# EAGLE design bugs (EAGLE 9.1.1)
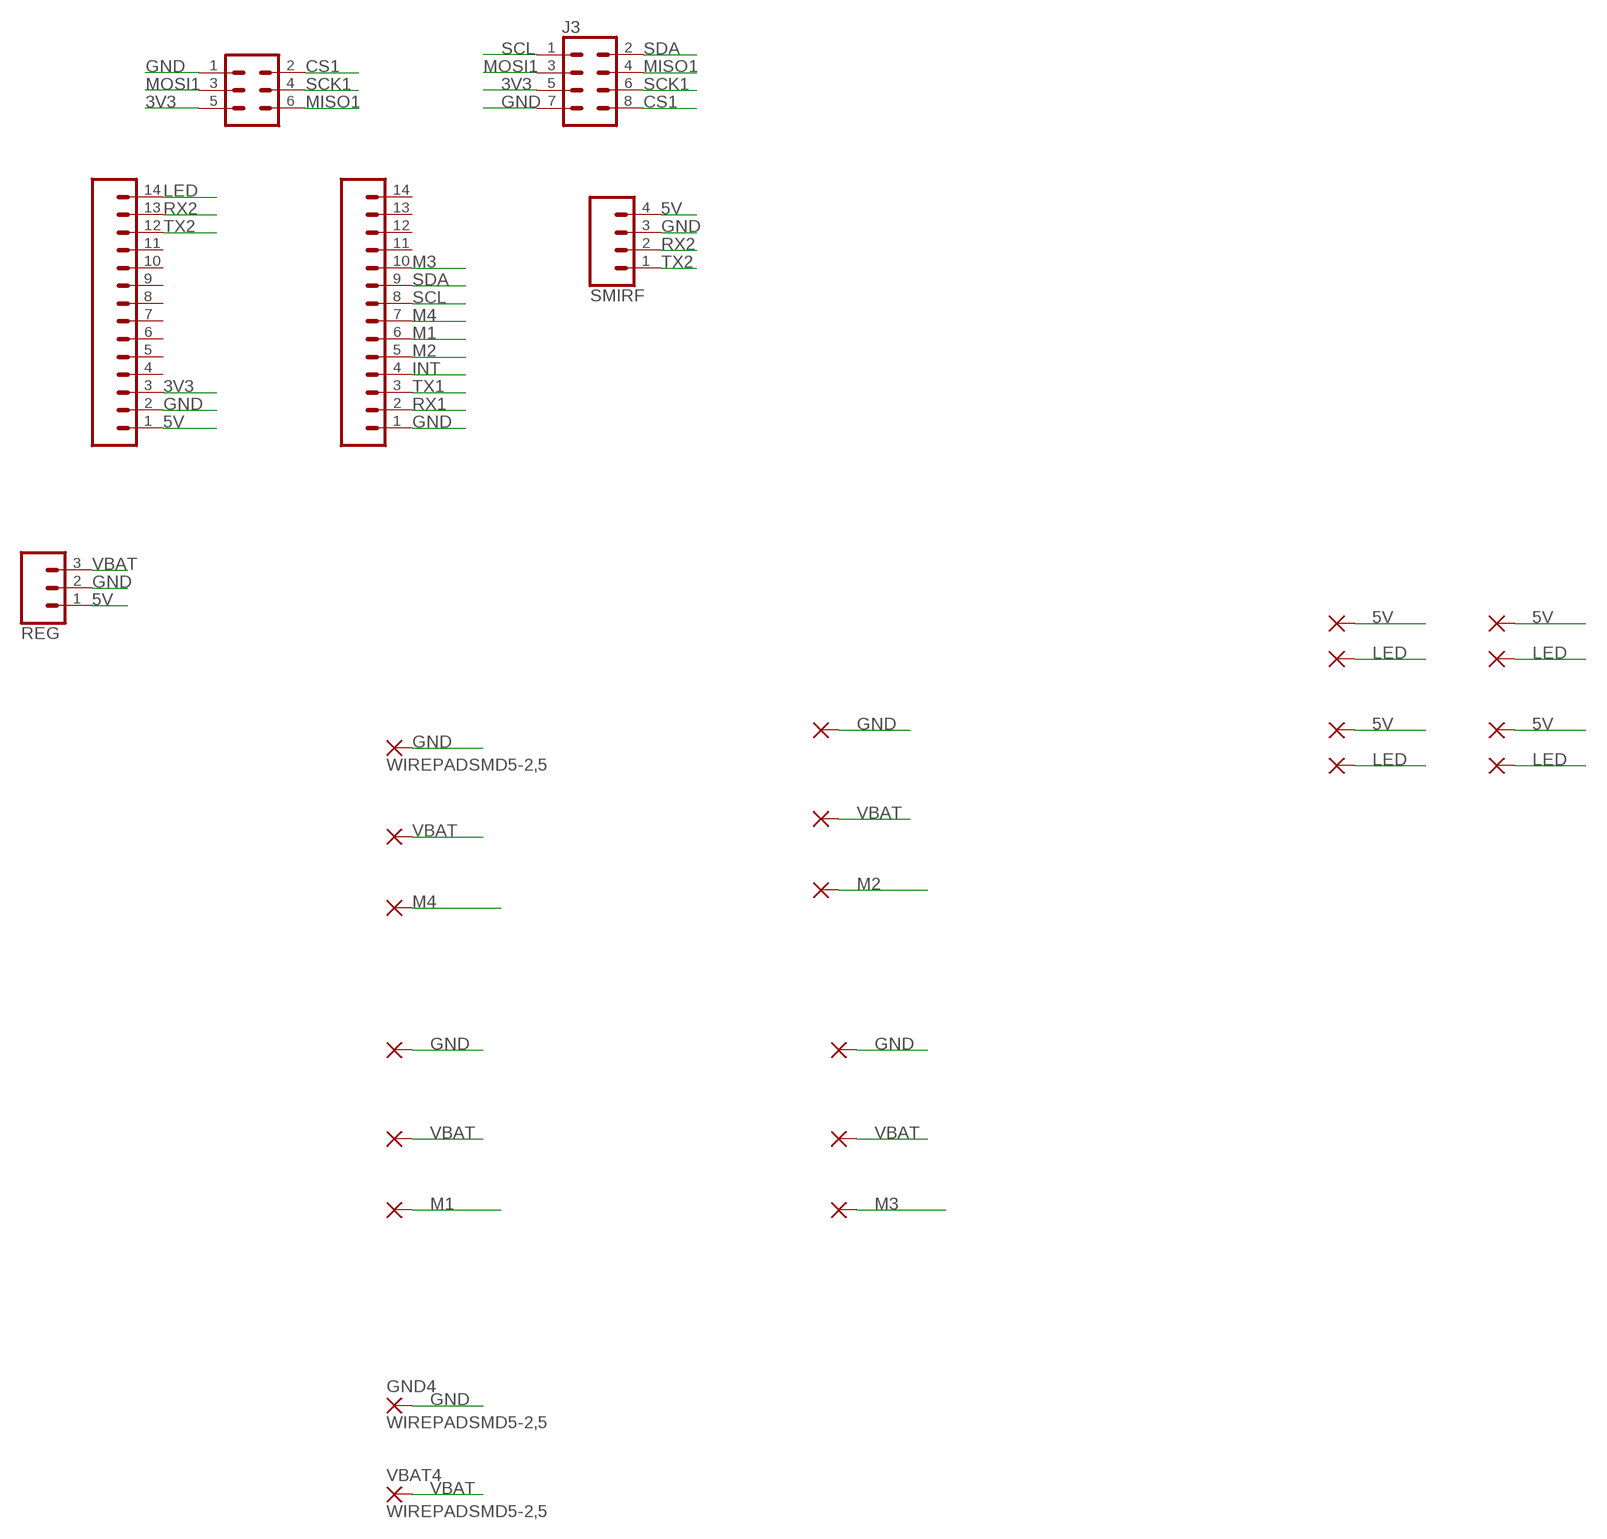
[diagram p0: schematic, sheet 1]

## Parts
GND  WIREPADSMD5-2,5  [5-2,5]
GND1  WIREPADSMD5-2,5  [5-2,5]
GND2  WIREPADSMD5-2,5  [5-2,5]
GND3  WIREPADSMD5-2,5  [5-2,5]
GND4  WIREPADSMD5-2,5  [5-2,5]
J1  CONN_03X2NO_SILK  [2X3-NS]
J3  CONN_04X2  [2X4]
J6  CONN_14NO_SILK  [1X14_NO_SILK]
J7  CONN_14NO_SILK  [1X14_NO_SILK]
M1  WIREPADSMD5-2,5  [5-2,5]
M2  WIREPADSMD5-2,5  [5-2,5]
M3  WIREPADSMD5-2,5  [5-2,5]
M4  WIREPADSMD5-2,5  [5-2,5]
PAD1  SMD2  [SMD1,27-2,54]
PAD2  SMD2  [SMD1,27-2,54]
PAD3  SMD2  [SMD1,27-2,54]
PAD4  SMD2  [SMD1,27-2,54]
PAD5  SMD2  [SMD1,27-2,54]
PAD6  SMD2  [SMD1,27-2,54]
PAD7  SMD2  [SMD1,27-2,54]
PAD8  SMD2  [SMD1,27-2,54]
REG  REG  CONN_031X03_NO_SILK  [1X03_NO_SILK]
SMIRF  SMIRF  CONN_041X04_NO_SILK  [1X04_NO_SILK]
VBAT  WIREPADSMD5-2,5  [5-2,5]
VBAT1  WIREPADSMD5-2,5  [5-2,5]
VBAT2  WIREPADSMD5-2,5  [5-2,5]
VBAT3  WIREPADSMD5-2,5  [5-2,5]
VBAT4  WIREPADSMD5-2,5  [5-2,5]

## Nets
3V3: J1.5 J3.5 J6.3
5V: J6.1 PAD1.1(P) PAD3.1(P) PAD5.1(P) PAD7.1(P) REG.1 SMIRF.4
CS1: J1.2 J3.8
GND: GND1.1(P) GND2.1(P) GND3.1(P) GND4.1(P) GND.1(P) J1.1 J3.7 J6.2 J7.1 REG.2 SMIRF.3
INT: J7.4
LED: J6.14 PAD2.1(P) PAD4.1(P) PAD6.1(P) PAD8.1(P)
M1: J7.6 M1.1(P)
M2: J7.5 M2.1(P)
M3: J7.10 M3.1(P)
M4: J7.7 M4.1(P)
MISO1: J1.6 J3.4
MOSI1: J1.3 J3.3
RX1: J7.2
RX2: J6.13 SMIRF.2
SCK1: J1.4 J3.6
SCL: J3.1 J7.8
SDA: J3.2 J7.9
TX1: J7.3
TX2: J6.12 SMIRF.1
VBAT: REG.3 VBAT1.1(P) VBAT2.1(P) VBAT3.1(P) VBAT4.1(P) VBAT.1(P)
Unconnected: J6.4 J6.5 J6.6 J6.7 J6.8 J6.9 J6.10 J6.11 J7.11 J7.12 J7.13 J7.14

## Library data of the parts
GND GND1-GND4 M1-M4 VBAT VBAT1-VBAT4 = wirepad:WIREPAD: Wire PAD connect wire on PCB
J1 = SparkFun-Connectors:CONN_03X2: Multi connection point. Often used as Generic Header-pin footprint for 0.1 inch spaced/style header connections You can populate with any combo of single row headers, but if you'd like an exact match, check these: Header - 2x3 (Male, 0.1") <https://www.sparkfun.com/products/12807> (PRT-12807) Header - 2x3 (Female, 0.1") <https://www.sparkfun.com/products/13010> (PRT-13010) 2x3 Pin Shrouded Header <https://www.sparkfun.com/products/10877> (PRT-10877) On any of the 0.1 inch spaced packages, you can populate with these: Break Away Headers - Straight <https://www.sparkfun.com/products/116> (PRT-00116) Break Away Male Headers - Right Angle <https://www.sparkfun.com/products/553> (PRT-00553) Female Headers <https://www.sparkfun.com/products/115> (PRT-00115) Break Away Headers - Machine Pin <https://www.sparkfun.com/products/117> (PRT-00117) Break Away Female Headers - Swiss Machine Pin <https://www.sparkfun.com/products/743> (PRT-00743) Special note: the shrouded connector mates well with our 3x2 ribbon cables: Ribbon Crimp Connector - 6-pin (2x3, Female) <https://www.sparkfun.com/products/10651> (PRT-10651) Ribbon Cable - 6 wire (15ft) <https://www.sparkfun.com/products/10646> (PRT-10646)
J3 = SparkFun-Connectors:CONN_04X2: Multi connection point. Often used as Generic Header-pin footprint for 0.1 inch spaced/style header connections On any of the 0.1 inch spaced packages, you can populate with these: Break Away Headers - Straight <https://www.sparkfun.com/products/116> (PRT-00116) Break Away Male Headers - Right Angle <https://www.sparkfun.com/products/553> (PRT-00553) Female Headers <https://www.sparkfun.com/products/115> (PRT-00115) Break Away Headers - Machine Pin <https://www.sparkfun.com/products/117> (PRT-00117) Break Away Female Headers - Swiss Machine Pin <https://www.sparkfun.com/products/743> (PRT-00743)
J6 J7 = SparkFun-Connectors:CONN_14: Multi connection point. Often used as Generic Header-pin footprint for 0.1 inch spaced/style header connections On any of the 0.1 inch spaced packages, you can populate with these: Break Away Headers - Straight <https://www.sparkfun.com/products/116> (PRT-00116) Break Away Male Headers - Right Angle <https://www.sparkfun.com/products/553> (PRT-00553) Female Headers <https://www.sparkfun.com/products/115> (PRT-00115) Break Away Headers - Machine Pin <https://www.sparkfun.com/products/117> (PRT-00117) Break Away Female Headers - Swiss Machine Pin <https://www.sparkfun.com/products/743> (PRT-00743) For SCREWTERMINALS and SPRING TERMINALS visit here: Screw Terimnals on SparkFun.com <https://www.sparkfun.com/search/results?term=Screw+Terminals> (5mm/3.5mm/2.54mm spacing) This device is also useful as a general connection point to wire up your design to another part of your project. Our various solder wires solder well into these plated through hole pads. Hook-Up Wire - Assortment (Stranded, 22 AWG) <https://www.sparkfun.com/products/11375> (PRT-11375) Hook-Up Wire - Assortment (Solid Core, 22 AWG) <https://www.sparkfun.com/products/11367> (PRT-11367) View the entire wire category on our website here <https://www.sparkfun.com/categories/141> Special notes: Molex polarized connector foot print use with SKU : PRT-08231 with associated crimp pins and housings. 1MM SMD Version SKU: PRT-10208 NOTES ON THE VARIANTS LOCK and LOCK_LONGPADS... This footprint was designed to help hold the alignment of a through-hole component (i.e. 6-pin header) while soldering it into place. You may notice that each hole has been shifted either up or down by 0.005 of an inch from it's more standard position (which is a perfectly straight line). This slight alteration caused the pins (the squares in the middle) to touch the edges of the holes. Because they are alternating, it causes a "brace" to hold the component in place. 0.005 has proven to be the perfect amount of "off-center" position when using our standard breakaway headers. Although looks a little odd when you look at the bare footprint, once you have a header in there, the alteration is very hard to notice. Also,if you push a header all the way into place, it is covered up entirely on the bottom side.
PAD1-PAD8 = wirepad:SMD2: SMD PAD
REG = SparkFun-Connectors:CONN_03: Multi connection point. Often used as Generic Header-pin footprint for 0.1 inch spaced/style header connections On any of the 0.1 inch spaced packages, you can populate with these: Break Away Headers - Straight <https://www.sparkfun.com/products/116> (PRT-00116) Break Away Male Headers - Right Angle <https://www.sparkfun.com/products/553> (PRT-00553) Female Headers <https://www.sparkfun.com/products/115> (PRT-00115) Break Away Headers - Machine Pin <https://www.sparkfun.com/products/117> (PRT-00117) Break Away Female Headers - Swiss Machine Pin <https://www.sparkfun.com/products/743> (PRT-00743) Stackable Header - 3 Pin (Female, 0.1") <https://www.sparkfun.com/products/13875> (PRT-13875) For SCREWTERMINALS and SPRING TERMINALS visit here: Screw Terimnals on SparkFun.com <https://www.sparkfun.com/search/results?term=Screw+Terminals> (5mm/3.5mm/2.54mm spacing) This device is also useful as a general connection point to wire up your design to another part of your project. Our various solder wires solder well into these plated through hole pads. Hook-Up Wire - Assortment (Stranded, 22 AWG) <https://www.sparkfun.com/products/11375> (PRT-11375) Hook-Up Wire - Assortment (Solid Core, 22 AWG) <https://www.sparkfun.com/products/11367> (PRT-11367) View the entire wire category on our website here <https://www.sparkfun.com/categories/141> Special notes: Molex polarized connector foot print use with SKU : PRT-08232 with associated crimp pins and housings.
SMIRF = SparkFun-Connectors:CONN_04: Multi connection point. Often used as Generic Header-pin footprint for 0.1 inch spaced/style header connections On any of the 0.1 inch spaced packages, you can populate with these: Break Away Headers - Straight <https://www.sparkfun.com/products/116> (PRT-00116) Break Away Male Headers - Right Angle <https://www.sparkfun.com/products/553> (PRT-00553) Female Headers <https://www.sparkfun.com/products/115> (PRT-00115) Break Away Headers - Machine Pin <https://www.sparkfun.com/products/117> (PRT-00117) Break Away Female Headers - Swiss Machine Pin <https://www.sparkfun.com/products/743> (PRT-00743) For SCREWTERMINALS and SPRING TERMINALS visit here: Screw Terimnals on SparkFun.com <https://www.sparkfun.com/search/results?term=Screw+Terminals> (5mm/3.5mm/2.54mm spacing) This device is also useful as a general connection point to wire up your design to another part of your project. Our various solder wires solder well into these plated through hole pads. Hook-Up Wire - Assortment (Stranded, 22 AWG) <https://www.sparkfun.com/products/11375> (PRT-11375) Hook-Up Wire - Assortment (Solid Core, 22 AWG) <https://www.sparkfun.com/products/11367> (PRT-11367) View the entire wire category on our website here <https://www.sparkfun.com/categories/141> Special notes: Molex polarized connector foot print use with SKU : PRT-08231 with associated crimp pins and housings. 1MM SMD Version SKU: PRT-10208; PROD_ID: CONN-09696

## Board
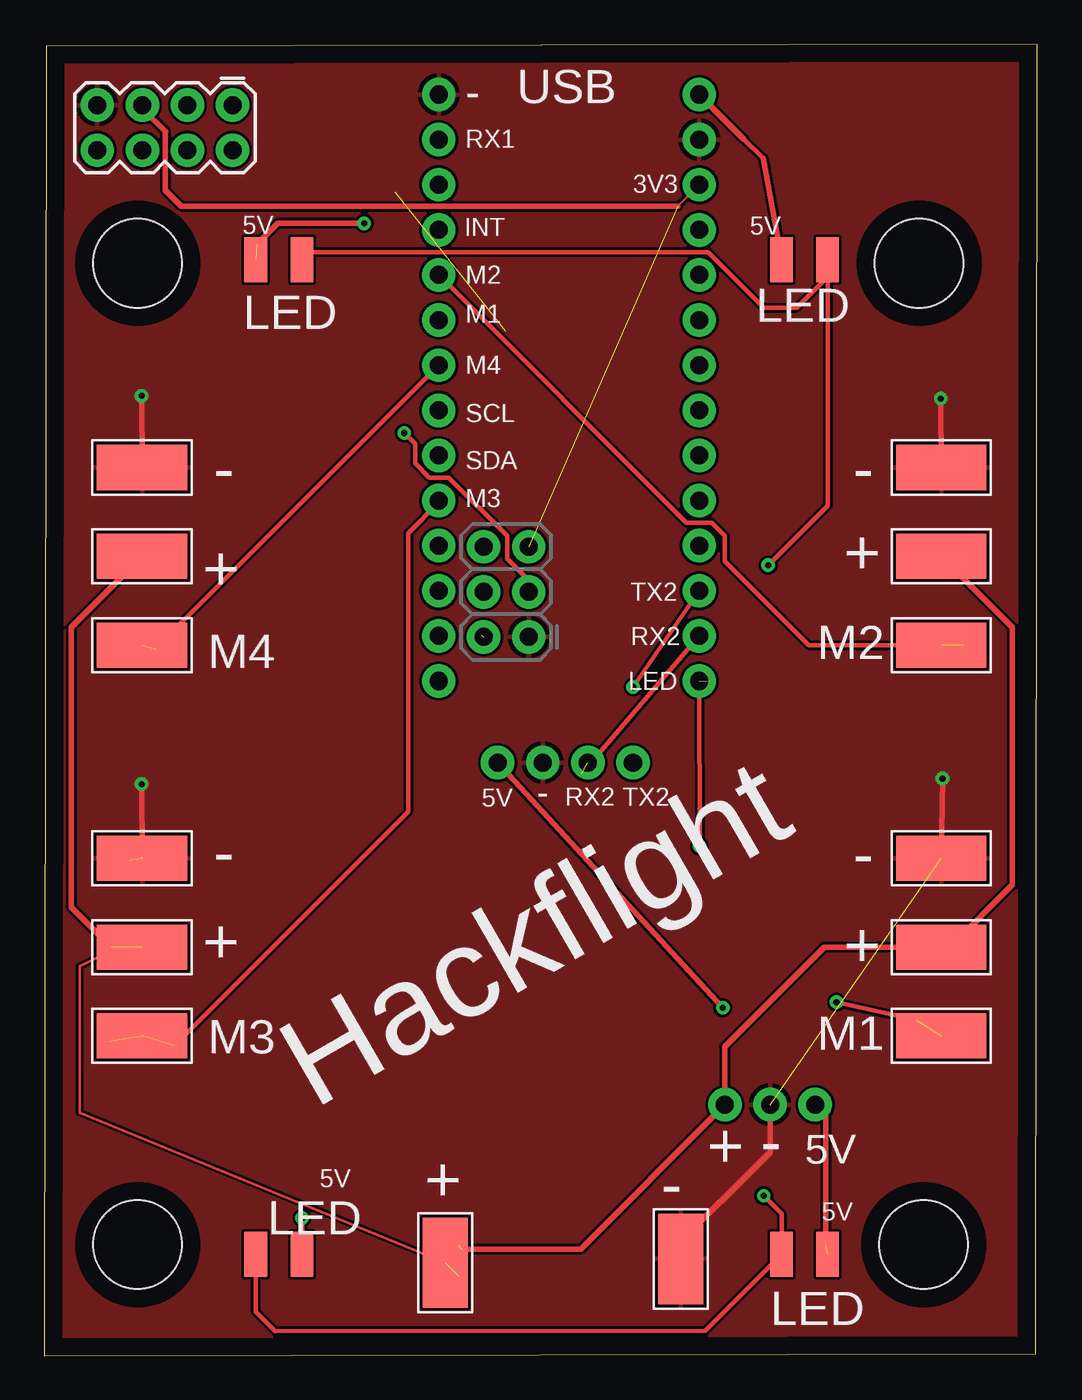
[diagram p1: board, top side]
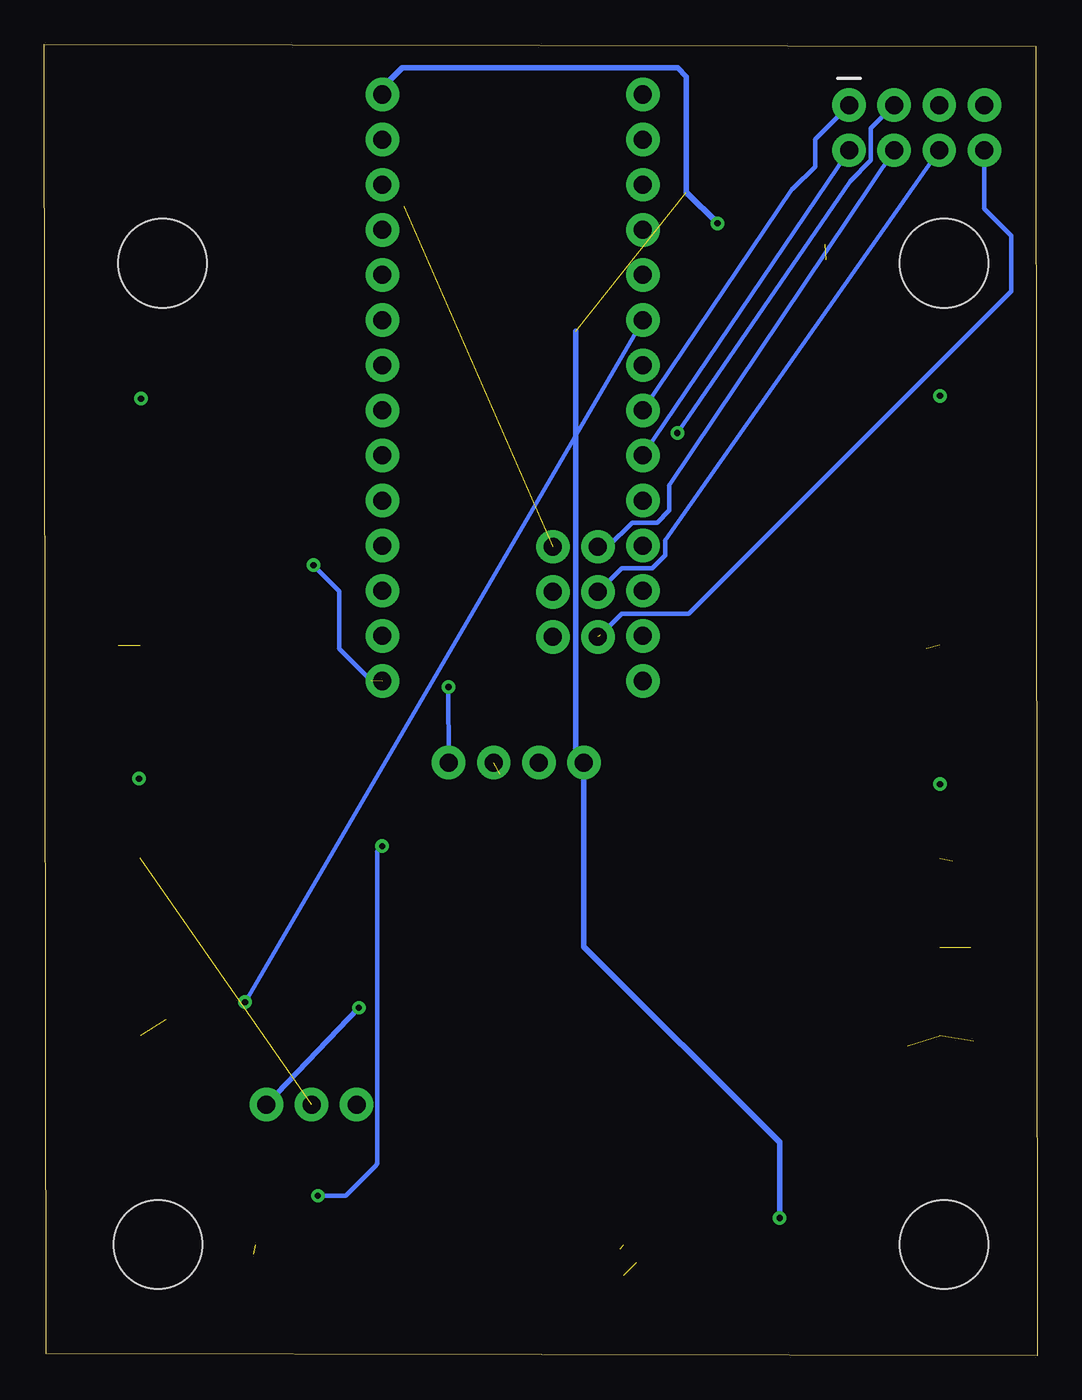
[diagram p2: board, bottom side, seen from below]

Size 55.9 x 73.82 mm. Coordinates in mm from the lower left corner, seen from the top.
Outline: 0,0 55.8,0.1 55.9,73.82 0.1,73.72 0,0
Copper layers (1*16): Top 0.035mm / dielectric 1.5mm / Bottom 0.035mm
Design rules "default": minimum track width 6mil, minimum drill 0.35mm, track to track 6mil, track to pad 6mil, pad to pad 6mil, via to via 6mil, smd to smd 6mil, copper to edge 40mil, drill to drill 6mil, minimum pad ring 10mil, minimum via ring 8mil, stop-mask expansion 4mil, vias tented up to drill 0mil, thermal gap 10mil
Holes 5 mm at 5.25,6.25 49.5,6.25 5.25,61.5 49.25,61.5

### Footprints (pad centres in the part's own frame; a part is rotated, then mirrored left to right if it is on the bottom)
5-2,5 = smd 2.54 x 5.08: 1 0,0
2X3-NS = drill 1.016 pad 1.88: 1 -2.54,-1.27; 2 -2.54,1.27; 3 0,-1.27; 4 0,1.27; 5 2.54,-1.27; 6 2.54,1.27
2X4 = drill 1.016 pad 1.88: 1 -3.81,-1.27; 2 -3.81,1.27; 3 -1.27,-1.27; 4 -1.27,1.27; 5 1.27,-1.27; 6 1.27,1.27; 7 3.81,-1.27; 8 3.81,1.27
1X14_NO_SILK = drill 1.016 pad 1.88: 1 0,0; 2 2.54,0; 3 5.08,0; 4 7.62,0; 5 10.16,0; 6 12.7,0; 7 15.24,0; 8 17.78,0; 9 20.32,0; 10 22.86,0; 11 25.4,0; 12 27.94,0; 13 30.48,0; 14 33.02,0
SMD1,27-2,54 = smd 1.27 x 2.54: 1 0,0
1X03_NO_SILK = drill 1.016 pad 1.88: 1 0,0; 2 2.54,0; 3 5.08,0
1X04_NO_SILK = drill 1.016 pad 1.88: 1 0,0; 2 2.54,0; 3 5.08,0; 4 7.62,0

### Placement (x,y rotation side)
GND  35.83,5.44 0 top
GND1  5.5,50 90 top
GND2  50.5,28 90 top
GND3  50.5,50 90 top
GND4  5.5,28 90 top
J1  26,43 90 top
J3  6.78,69.13 180 top
J6  36.87,71 270 top
J7  22.2,71 270 top
M1  50.5,18 90 top
M2  50.5,40 90 top
M3  5.5,18 90 top
M4  5.5,40 90 top
PAD1  44.1,5.7 0 top
PAD2  41.5,5.7 0 top
PAD3  11.9,61.7 0 top
PAD4  14.5,61.7 0 top
PAD5  14.5,5.7 0 top
PAD6  11.9,5.7 0 top
PAD7  41.5,61.7 0 top
PAD8  44.1,61.7 0 top
REG  43.4,14.13 180 top
SMIRF  33.14,33.38 180 top
VBAT  22.58,5.23 0 top
VBAT1  5.5,45 90 top
VBAT2  50.5,23 90 top
VBAT3  50.5,45 90 top
VBAT4  5.5,23 90 top

### Tracks (layer width: path | path; a pad name or v marks a point on that pad's centre or on a via)
3V3  (1 unrouted)
  Top 0.152: 35.66,64.71 J6.3 | 6.83,68.9 6.8,68.88
  Top 0.305: 6.83,68.9 5.51,70.21 J3.5 | 35.66,64.71 7.71,64.71 6.8,65.61 6.8,68.88
5V  (via drill 0.35)  (3 unrouted)
  Top 0.254: 39.39,68.48 40.46,67.41
  Top 0.305: J6.1 39.39,68.48 | v38.2,19.58 SMIRF.4 | 40.46,67.41 PAD7.1 | REG.1 44,13.53 44,6.25 | v14.5,7.75 PAD5.1 | v18,63.75 13.15,63.75 11.97,62.57
  Bottom 0.305: REG.1 v38.2,19.58 | 25.98,57.67 25.98,33.84 SMIRF.4 25.52,23.02 14.5,12 v14.5,7.75 | v18,63.75 19.75,65.5 19.75,72 20.25,72.5 35.75,72.5 36.87,71.38 J6.1
CS1  (1 unrouted)
  Bottom 0.152: 19.62,41.78 19.64,41.75
  Bottom 0.254: J3.8 2.97,64.56 1.46,63.05 1.46,59.94 19.62,41.78 | 19.64,41.75 23.39,41.75 24.6,40.55 24.96,40.55
GND  (via drill 0.35)  (2 unrouted)
  Top 0.152: GND1.1 7.4,50 | 4.05,27.87 4.79,27.87 | 50.46,53.83 v50.46,53.88
  Top 0.305: REG.2 40.85,11.46 35.3,5.9 | GND1.1 v5.48,54.03 | GND4.1 v5.48,32.17 | GND2.1 v50.57,32.48 | GND3.1 50.46,53.83
  pour Top: 0.25,73.78 55.9,73.78 55.9,-0.25 0.25,-0.25
LED  (via drill 0.35)  (1 unrouted)
  Top 0.152: 36.88,28.64 v36.88,28.68 | 14.91,62.11 PAD4.1
  Top 0.254: J6.14 36.88,28.64 | PAD8.1 44.1,60.75 | 44.1,60.75 44.11,47.86 v40.75,44.5 | v40.5,9 41.5,8 PAD2.1 37.21,1.41 13,1.36 11.9,2.47 PAD6.1 | 44.1,60.75 42.35,59 40.5,59 37.39,62.11 21.29,62.11 14.91,62.11
  Bottom 0.152: v36.88,28.68 36.88,28.67
  Bottom 0.254: 36.88,28.67 37.15,28.4 37.15,10.79 37.3,10.64 37.21,10.73 38.94,9 v40.5,9 | 37.5,38 39.29,39.79 39.29,43.04 v40.75,44.5
M1  (via drill 0.35)  (1 unrouted)
  Top 0.254: v44.6,19.9 49.05,18.9
  Bottom 0.254: J7.6 22.2,58.27 44.56,19.94 v44.6,19.9
M2  (1 unrouted)
  Top 0.152: 50.2,40.3 M2.1
  Top 0.254: 51.75,40 43.04,40 38.31,44.73 38.31,46.15 37.56,46.9 36.15,46.9 J7.5
M3  (2 unrouted)
  Top 0.152: 3.6,17.7 3.6,17.2 | J7.10 22.2,48.04
  Top 0.254: 22.2,48.04 20.48,46.31 20.48,30.62 7.3,17.44
M4  (1 unrouted)
  Top 0.152: 6.25,39.81 6.25,39.75
  Top 0.254: J7.7 6.25,39.81
MISO1
  Bottom 0.254: J3.4 20.72,49.01 20.72,47.58 21.4,46.9 22.81,46.9 24.17,45.54 J1.6
MOSI1  (via drill 0.35)
  Top 0.254: v20.26,51.94 20.87,51.33 20.87,50.23 21.67,49.43 22.77,49.43 26.05,46.15 26.05,44.87 27.27,43.65 J1.3
  Bottom 0.254: J3.3 9.36,69.09 9.36,67.29 10.53,66.12 v20.26,51.94
RX2  (1 unrouted)
  Top 0.254: J6.13 30.23,32.74
SCK1
  Bottom 0.152: 20.93,45.9 20.95,45.89
  Bottom 0.254: J3.6 20.93,45.9 | 20.95,45.89 20.95,45.06 21.67,44.33 23.4,44.33 J1.4
SCL
  Bottom 0.152: 13.78,65.68 13.77,65.68
  Bottom 0.254: J7.8 13.78,65.68 | 13.77,65.68 12.51,66.94 12.51,68.49 J3.1
SDA
  Bottom 0.254: J3.2 J7.9
TX2  (via drill 0.35)
  Top 0.254: J6.12 v33.15,37.64
  Bottom 0.254: v33.15,37.64 SMIRF.1
VBAT  (3 unrouted)
  Top 0.152: 23.3,6.2 23.3,4.5 | 38.3,14.11 37.99,13.81 | 51,23 49,23 48.51,23 49.11,23 | VBAT3.1 49,45 | 3.75,23 3.75,22.79 | 3.75,22.79 3.75,22.5 | VBAT.1 1.98,13.67 1.98,21.93 3.75,22.79
  Top 0.305: REG.3 37.99,13.81 30.19,6 23.5,6 | VBAT2.1 49.11,23 49,23 43.9,23 38.3,17.4 38.3,14.11 | VBAT1.1 1.5,41 1.5,25.25 3.75,23 | VBAT4.1 6.5,23 | VBAT3.1 54.5,41 54.5,26.5 51,23

### Text on the board
tNames: - | USB | RX1 | 3V3 | 5V | INT | 5V | M2 | LED | M1 | LED | M4 | SCL | SDA | - | - | M3 | + | + | TX2 | RX2 | M4 | M2 | LED | 5V | - | RX2 | TX2 | - | - | + | + | M3 | M1 | Hackflight | + | - | 5V | 5V | + | - | 5V | LED | LED